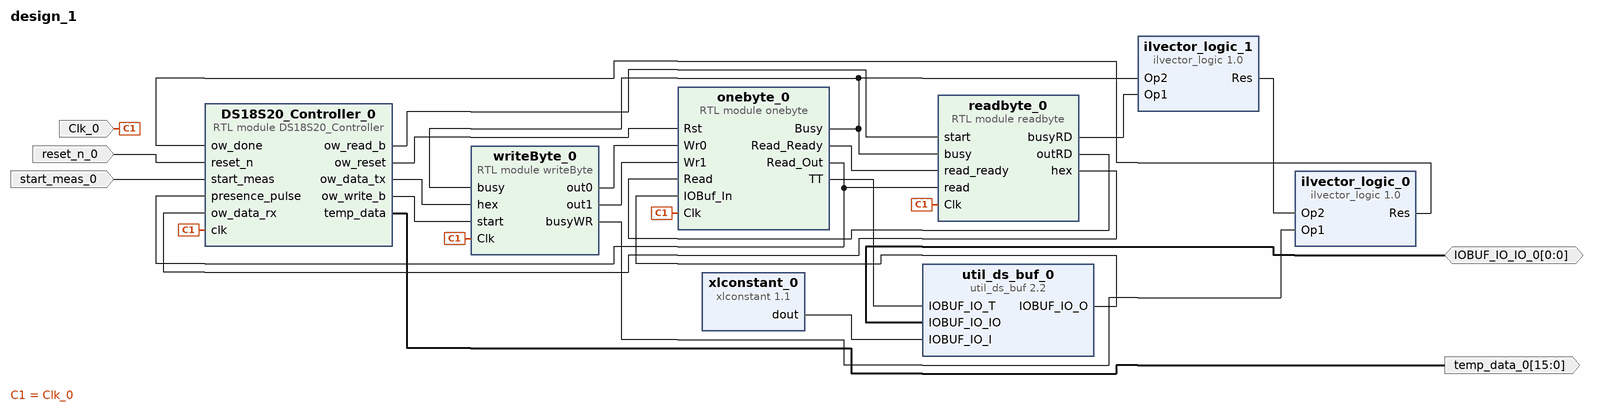
[diagram p0: block diagram of the top level]
# Vivado block design design_1, xczu3eg-sfvc784-2-e, Vivado 2025.1
create_bd_design design_1

create_bd_port -dir I -type clk Clk_0
create_bd_port -dir IO -from 0 -to 0 IOBUF_IO_IO_0
create_bd_port -dir O -from 15 -to 0 temp_data_0
create_bd_port -dir I start_meas_0
create_bd_port -dir I -type rst reset_n_0

create_bd_cell -type module -reference onebyte onebyte_0
create_bd_cell -type module -reference writeByte writeByte_0
create_bd_cell -type ip -vlnv xilinx.com:ip:util_ds_buf:2.2 util_ds_buf_0
set_property -dict {CONFIG.C_BUF_TYPE IOBUF} [get_bd_cells util_ds_buf_0]
create_bd_cell -type ip -vlnv xilinx.com:ip:xlconstant:1.1 xlconstant_0
set_property -dict {CONFIG.CONST_VAL 0} [get_bd_cells xlconstant_0]
create_bd_cell -type module -reference readbyte readbyte_0
create_bd_cell -type module -reference DS18S20_Controller DS18S20_Controller_0
create_bd_cell -type inline_hdl -vlnv xilinx.com:inline_hdl:ilvector_logic:1.0 ilvector_logic_0
set_property -dict {CONFIG.C_OPERATION or CONFIG.C_SIZE 1} [get_bd_cells ilvector_logic_0]
create_bd_cell -type inline_hdl -vlnv xilinx.com:inline_hdl:ilvector_logic:1.0 ilvector_logic_1
set_property -dict {CONFIG.C_OPERATION or CONFIG.C_SIZE 1} [get_bd_cells ilvector_logic_1]

# ---- connections ----

connect_bd_net -net Clk_0_1 [get_bd_ports Clk_0] \
  [get_bd_pins writeByte_0/Clk] [get_bd_pins onebyte_0/Clk] [get_bd_pins readbyte_0/Clk] \
  [get_bd_pins DS18S20_Controller_0/clk]
connect_bd_net [get_bd_pins DS18S20_Controller_0/ow_data_tx] [get_bd_pins writeByte_0/hex]
connect_bd_net [get_bd_pins DS18S20_Controller_0/ow_read_b] [get_bd_pins readbyte_0/start]
connect_bd_net [get_bd_pins DS18S20_Controller_0/ow_reset] [get_bd_pins onebyte_0/Rst]
connect_bd_net [get_bd_pins DS18S20_Controller_0/ow_write_b] [get_bd_pins writeByte_0/start]
connect_bd_net [get_bd_pins DS18S20_Controller_0/temp_data] [get_bd_ports temp_data_0]
connect_bd_net [get_bd_ports IOBUF_IO_IO_0] [get_bd_pins util_ds_buf_0/IOBUF_IO_IO]
connect_bd_net [get_bd_pins ilvector_logic_0/Res] [get_bd_pins DS18S20_Controller_0/ow_done]
connect_bd_net [get_bd_pins ilvector_logic_1/Res] [get_bd_pins ilvector_logic_0/Op2]
connect_bd_net [get_bd_pins onebyte_0/Busy] [get_bd_pins writeByte_0/busy] [get_bd_pins readbyte_0/busy] [get_bd_pins ilvector_logic_1/Op2]
connect_bd_net [get_bd_pins onebyte_0/Read_Out] [get_bd_pins DS18S20_Controller_0/presence_pulse] [get_bd_pins readbyte_0/read]
connect_bd_net [get_bd_pins onebyte_0/Read_Ready] [get_bd_pins readbyte_0/read_ready]
connect_bd_net [get_bd_pins onebyte_0/TT] [get_bd_pins util_ds_buf_0/IOBUF_IO_T]
connect_bd_net [get_bd_pins readbyte_0/busyRD] [get_bd_pins ilvector_logic_1/Op1]
connect_bd_net [get_bd_pins readbyte_0/hex] [get_bd_pins DS18S20_Controller_0/ow_data_rx]
connect_bd_net [get_bd_pins readbyte_0/outRD] [get_bd_pins onebyte_0/Read]
connect_bd_net -net reset_n_0_1 [get_bd_ports reset_n_0] [get_bd_pins DS18S20_Controller_0/reset_n]
connect_bd_net -net start_meas_0_1 [get_bd_ports start_meas_0] [get_bd_pins DS18S20_Controller_0/start_meas]
connect_bd_net [get_bd_pins util_ds_buf_0/IOBUF_IO_O] [get_bd_pins onebyte_0/IOBuf_In]
connect_bd_net [get_bd_pins writeByte_0/busyWR] [get_bd_pins ilvector_logic_0/Op1]
connect_bd_net [get_bd_pins writeByte_0/out0] [get_bd_pins onebyte_0/Wr0]
connect_bd_net [get_bd_pins writeByte_0/out1] [get_bd_pins onebyte_0/Wr1]
connect_bd_net [get_bd_pins xlconstant_0/dout] [get_bd_pins util_ds_buf_0/IOBUF_IO_I]

validate_bd_design
save_bd_design
